# Altium schematic sheet Other.SchDoc
size Tabloid; DocumentNumber: 9; SheetNumber: 9; SheetTotal: 11; SheetName: LEDs and I2C exp. connector
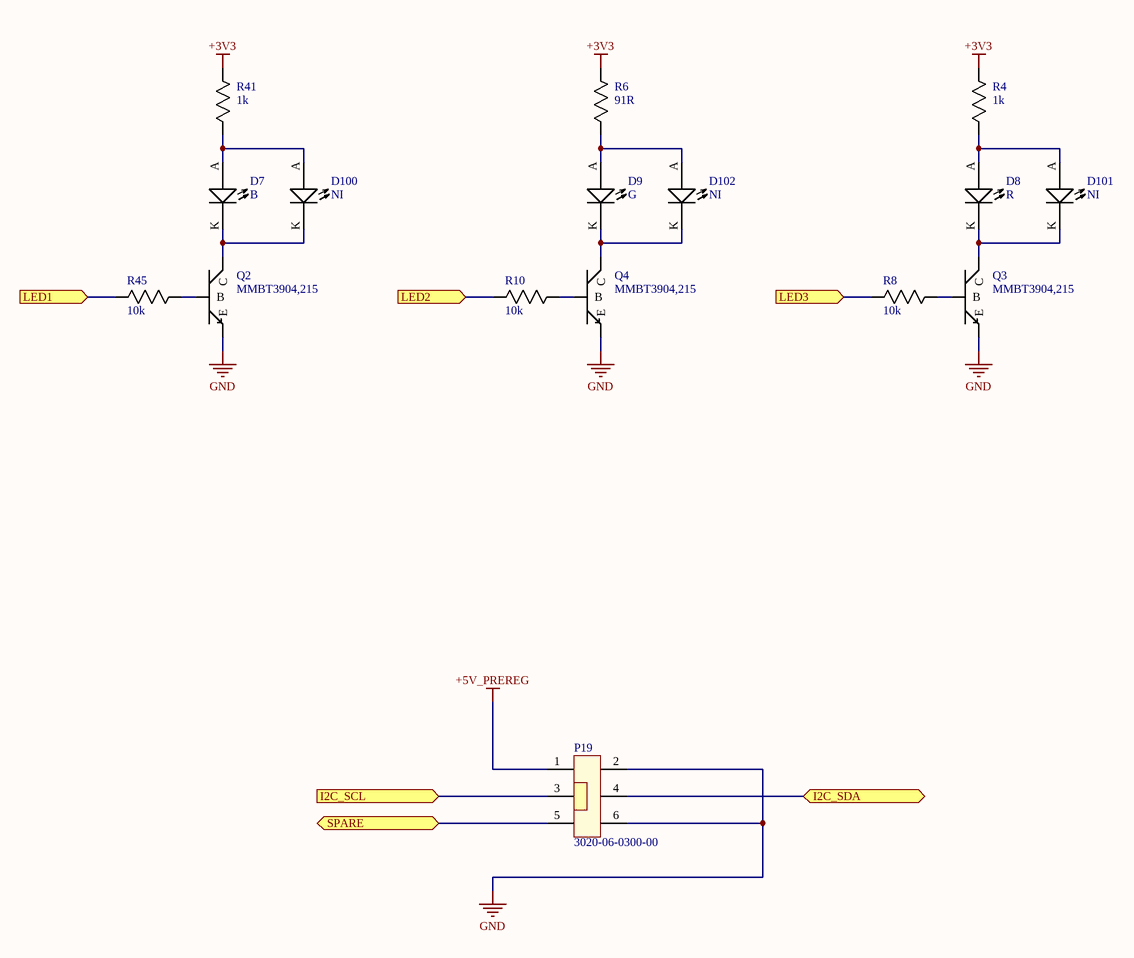
[diagram p0: Other.SchDoc]

## Parts
D7  Type: B  [0805_LED]  (hidden comment: Diode_LED)
D8  Type: R  [0805_LED]  (hidden comment: Diode_LED)
D9  Type: G  [0805_LED]  (hidden comment: Diode_LED)
D100  Diode_LED  [0805_LED]  (value not drawn)
D101  Diode_LED  [0805_LED]  (value not drawn)
D102  Diode_LED  [0805_LED]  (value not drawn)
P19  Mfg_PN: 3020-06-0300-00  [CONN6_100mils_pol_SMD]  (hidden comment: CON6_3020-06-0300-00)
Q2  Mfg_PN: MMBT3904,215  [SOT23_GDS]  (hidden comment: BJT_N_GDS)
Q3  Mfg_PN: MMBT3904,215  [SOT23_GDS]  (hidden comment: BJT_N_GDS)
Q4  Mfg_PN: MMBT3904,215  [SOT23_GDS]  (hidden comment: BJT_N_GDS)
R4  value 1k  [0603]  (hidden comment: Resistor)
R6  value 91R  [0603]  (hidden comment: Resistor)
R8  value 10k  [0603]  (hidden comment: Resistor)
R10  value 10k  [0603]  (hidden comment: Resistor)
R41  value 1k  [0603]  (hidden comment: Resistor)
R45  value 10k  [0603]  (hidden comment: Resistor)

## Ports
I2C_SCL (in), I2C_SDA (bidir), LED1 (in), LED2 (in), LED3 (in), SPARE (bidir)

## Nets
+3V3: R4.2 R6.2 R41.2
+5V_PREREG: P19.1
GND: P19.2 P19.6 Q2.S(E) Q3.S(E) Q4.S(E)
I2C_SCL: P19.3 ; port I2C_SCL
I2C_SDA: P19.4 ; port I2C_SDA
LED1: R45.1 ; port LED1
LED2: R10.1 ; port LED2
LED3: R8.1 ; port LED3
SPARE: P19.5 ; port SPARE
NetD7_A: D7.A D100.A R41.1
NetD7_K: D7.K D100.K Q2.D(C)
NetD8_A: D8.A D101.A R4.1
NetD8_K: D8.K D101.K Q3.D(C)
NetD9_A: D9.A D102.A R6.1
NetD9_K: D9.K D102.K Q4.D(C)
NetQ2_G: Q2.G(B) R45.2
NetQ3_G: Q3.G(B) R8.2
NetQ4_G: Q4.G(B) R10.2

## Notes on the sheet
- Sheet name
- http://creativecommons.org
- Project name
- Contact
- Rev
- Date
- Sheet
- of

## Library data of the parts
D7 = Diode_LED: LED; Mfg: Wurth; Mfg_PN: 150080BS75000; HelpURL: *; NI: *; Supplier1: Digikey; Supplier1_PN: 732-4982-1-ND; Tolerance: *; Rating: *; Value: *
D8 = Diode_LED: LED; Mfg: Osram; Mfg_PN: LS R976-NR-1; HelpURL: *; NI: *; Supplier1: Digikey; Supplier1_PN: 475-1278-1-ND; Tolerance: *; Rating: *; Value: *
D9 = Diode_LED: LED; Mfg: Osram; Mfg_PN: LG R971-KN-1; HelpURL: *; NI: *; Supplier1: Digikey; Supplier1_PN: 475-1410-1-ND; Tolerance: *; Rating: *; Value: *
D100-D102 = Diode_LED: LED; Type: R; HelpURL: *; Mfg: *; Mfg_PN: *; NI: NI; Supplier1: *; Supplier1_PN: *; Tolerance: *; Rating: *; Value: *
P19 = CON6_3020-06-0300-00: 6-pins; Mfg: Harwin; HelpURL: *; NI: *; Rating: *; Supplier1: Digikey; Supplier1_PN: 3020-06-0300-00-ND; Tolerance: *; Type: *; Value: *
Q2-Q4 = BJT_N_GDS: BJT NPN; Mfg: NXP; HelpURL: *; NI: *; Rating: *; Supplier1: Digikey; Supplier1_PN: 568-4510-1-ND; Tolerance: *; Type: *; Value: *
R4 R41 = Resistor: Mfg: Yageo; Mfg_PN: RC0603JR-071KL; HelpURL: *; NI: *; Supplier1: Digikey; Supplier1_PN: 311-1.0KGRCT-ND; Type: *; Rating: *; Tolerance: *
R6 = Resistor: Mfg: Yageo; Mfg_PN: RC0603JR-0791RL; HelpURL: *; NI: *; Supplier1: Digikey; Supplier1_PN: 311-91GRCT-ND; Type: *; Rating: *; Tolerance: *
R8 R10 R45 = Resistor: Mfg: Yageo; Mfg_PN: RC0603JR-0710KL; HelpURL: *; NI: *; Supplier1: Digikey; Supplier1_PN: 311-10KGRCT-ND; Type: *; Rating: *; Tolerance: *